# EAGLE board touch_glove (EAGLE 8.6.2)
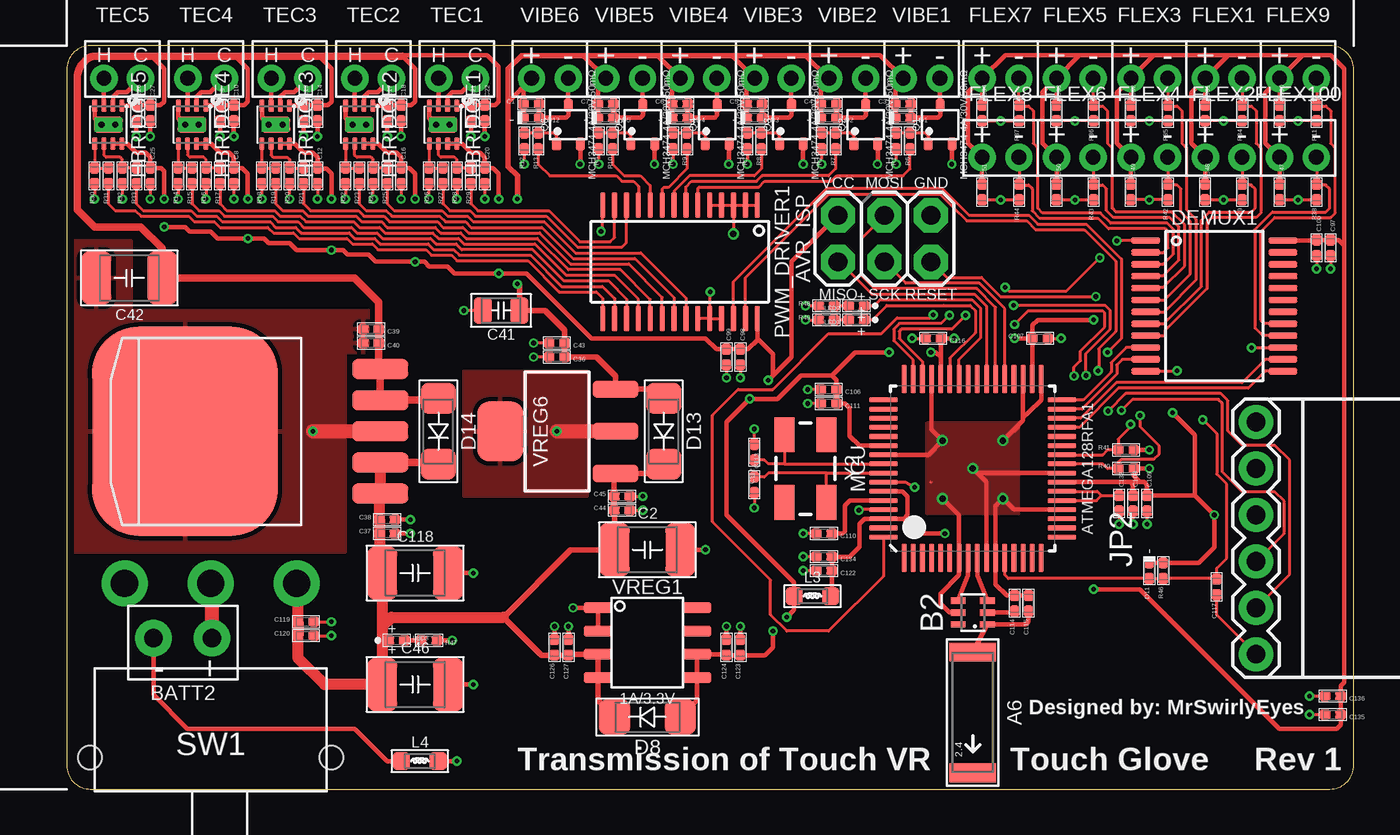
[diagram p5: board, top side]
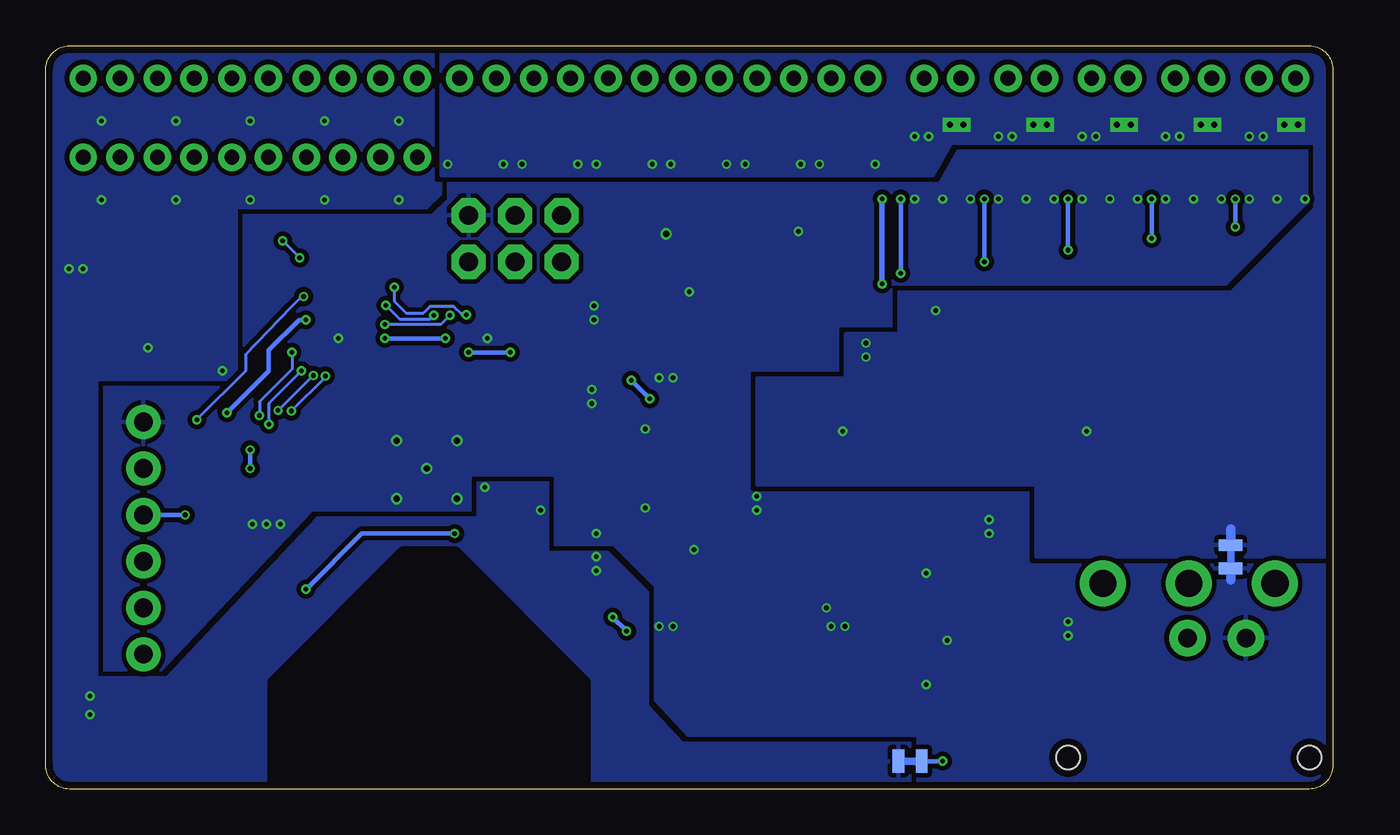
[diagram p6: board, bottom side, seen from below]

Size 70.36 x 40.64 mm. Coordinates in mm from the lower left corner, seen from the top.
Outline: 69.06,40.64 1.3,40.64 arc90 0,39.34 0,1.3 arc90 1.3,0 69.06,0 arc90 70.36,1.3 70.36,39.34 arc90 69.06,40.64
Copper layers (1*16): Top 0.035559375mm / dielectric 1.6mm / Bottom 0.035559375mm
Design rules "oshpark-2layer": minimum track width 6mil, minimum drill 10mil, track to track 6mil, track to pad 6mil, pad to pad 6mil, via to via 6mil, smd to smd 6mil, copper to edge 15mil, drill to drill 6mil, minimum pad ring 5mil, minimum via ring 5mil, stop-mask expansion 2.5mil, vias tented up to drill 0mil, thermal gap 10mil
bRestrict: area 40.9,0.5 to 57.9,13

## Footprints (pad centres in the part's own frame; a part is rotated, then mirrored left to right if it is on the bottom)
ANTENNA-CHIP5 = smd 1.016 x 2.54: FEED -3.302,0; NC 3.302,0
2PT_GND_TIE = smd 0.635 x 1.27: P$1 -0.635,0; P$2 0.635,0
2X3-NS = drill 1.016 pad 1.88 octagon: 1 -2.54,-1.27; 2 -2.54,1.27; 3 0,-1.27; 4 0,1.27; 5 2.54,-1.27; 6 2.54,1.27
0805_BALUN = smd 0.35 x 0.8: 1 -0.65,-0.8; 2 0,-0.8; 3 0.65,-0.8; 4 0.65,0.8; 5 0,0.8; 6 -0.65,0.8
DUAL_PTH_PADS = drill 1 pad 2: + -1.6,0; - 1.6,0
_CER_SMD_0402 = smd 0.6 x 0.55: 1 -0.425,0; 2 0.425,0
_CER_SMD-1210 = smd 1.65 x 2.9: 1 -1.8,0; 2 1.8,0
_CER_SMD-805 = smd 1 x 1.45: 1 -1,0; 2 1,0
SOD-923F/0402 = smd 0.6 x 0.55: A -0.425,0; K 0.425,0
SOD123F = smd 1.7 x 1.9: A -1.8,0; K 1.8,0
SSOP-24 = smd 1.6 x 0.35: 1 -3.75,3.575; 2 -3.75,2.925; 3 -3.75,2.275; 4 -3.75,1.625; 5 -3.75,0.975; 6 -3.75,0.325; 7 -3.75,-0.325; 8 -3.75,-0.975; 9 -3.75,-1.625; 10 -3.75,-2.275; 11 -3.75,-2.925; 12 -3.75,-3.575; 13 3.75,-3.575; 14 3.75,-2.925; 15 3.75,-2.275; 16 3.75,-1.625; 17 3.75,-0.975; 18 3.75,-0.325; 19 3.75,0.325; 20 3.75,0.975; 21 3.75,1.625; 22 3.75,2.275; 23 3.75,2.925; 24 3.75,3.575
CONNECTOR_FSR = drill 0.8 pad 1.5: + -1,-1.27; - 1,-1.27
WSON-8-PPAD = smd 0.7 x 0.28: 1 -1.035,0.75; 2 -1.035,0.25; 3 -1.035,-0.25; 4 -1.035,-0.75; 5 1.035,-0.75; 6 1.035,-0.25; 7 1.035,0.25; 8 1.035,0.75 | smd 0.9 x 1.6: GND 0,0 | drill 0.33 pad 0.75 square: P$1 0,-0.38; P$2 0,0.37
FTDI_BASIC-6PIN-MALE-RA = drill 1.016 pad 1.88: CTS 10.16,0; DTR 0,0; GND 12.7,0; RXI 2.54,0; TXO 5.08,0; VCC 7.62,0
_SMD-0603 = smd 0.95 x 1: 1 -1,0; 2 1,0
LED_SMD-0402 = smd 0.6 x 0.55: A -0.425,0; K 0.425,0
VFQFN-64 = smd 1.562 x 0.28: 1 -4.881,3.75; 2 -4.881,3.25; 3 -4.881,2.75; 4 -4.881,2.25; 5 -4.881,1.75; 6 -4.881,1.25; 7 -4.881,0.75; 8 -4.881,0.25; 9 -4.881,-0.25; 10 -4.881,-0.75; 11 -4.881,-1.25; 12 -4.881,-1.75; 13 -4.881,-2.25; 14 -4.881,-2.75; 15 -4.881,-3.25; 16 -4.881,-3.75; 33 4.881,-3.75; 34 4.881,-3.25; 35 4.881,-2.75; 36 4.881,-2.25; 37 4.881,-1.75; 38 4.881,-1.25; 39 4.881,-0.75; 40 4.881,-0.25; 41 4.881,0.25; 42 4.881,0.75; 43 4.881,1.25; 44 4.881,1.75; 45 4.881,2.25; 46 4.881,2.75; 47 4.881,3.25; 48 4.881,3.75 | smd 0.28 x 1.562: 17 -3.75,-4.881; 18 -3.25,-4.881; 19 -2.75,-4.881; 20 -2.25,-4.881; 21 -1.75,-4.881; 22 -1.25,-4.881; 23 -0.75,-4.881; 24 -0.25,-4.881; 25 0.25,-4.881; 26 0.75,-4.881; 27 1.25,-4.881; 28 1.75,-4.881; 29 2.25,-4.881; 30 2.75,-4.881; 31 3.25,-4.881; 32 3.75,-4.881; 49 3.75,4.881; 50 3.25,4.881; 51 2.75,4.881; 52 2.25,4.881; 53 1.75,4.881; 54 1.25,4.881; 55 0.75,4.881; 56 0.25,4.881; 57 -0.25,4.881; 58 -0.75,4.881; 59 -1.25,4.881; 60 -1.75,4.881; 61 -2.25,4.881; 62 -2.75,4.881; 63 -3.25,4.881; 64 -3.75,4.881
TSSOP-28 = smd 1.4 x 0.3: 1 -3.1,4.225; 2 -3.1,3.575; 3 -3.1,2.925; 4 -3.1,2.275; 5 -3.1,1.625; 6 -3.1,0.975; 7 -3.1,0.325; 8 -3.1,-0.325; 9 -3.1,-0.975; 10 -3.1,-1.625; 11 -3.1,-2.275; 12 -3.1,-2.925; 13 -3.1,-3.575; 14 -3.1,-4.225; 15 3.1,-4.225; 16 3.1,-3.575; 17 3.1,-2.925; 18 3.1,-2.275; 19 3.1,-1.625; 20 3.1,-0.975; 21 3.1,-0.325; 22 3.1,0.325; 23 3.1,0.975; 24 3.1,1.625; 25 3.1,2.275; 26 3.1,2.925; 27 3.1,3.575; 28 3.1,4.225
SC-70FL/MCPH3 = smd 0.5 x 0.7: 1 -0.65,-1.05; 2 0.65,-1.05; 3 0,1.05
RESISTOR_SMD-0402 = smd 0.6 x 0.55: 1 -0.425,0; 2 0.425,0
SW_SLIDE_RA_SPDT_4A-28V_L12.7-W9.5 = drill 1.5 pad 2.5: P 0,-4.765; S1 -4.7,-4.765; S2 4.7,-4.765 | hole 1.3: -6.605,4.765; 6.605,4.765
CONNECTOR_PELTIER = drill 0.8 pad 1.5: COLD 1,-1.27; HOT -1,-1.27
CONNECTOR_VIBE-MOTOR = drill 0.8 pad 1.5: 1 -1,-1.27; 2 1,-1.27
SOIC-8_W3.9MM = smd 1.55 x 0.6: 1 -2.7,1.905; 2 -2.7,0.635; 3 -2.7,-0.635; 4 -2.7,-1.905; 5 2.7,-1.905; 6 2.7,-0.635; 7 2.7,0.635; 8 2.7,1.905
SOT223-4 = smd 0.95 x 2.5: 1 -2.3,-3.199; 2 0,-3.199; 3 2.3,-3.199 | smd 3.25 x 2.5: TAB 0,3.099
DDPAK-5 = smd 1.067 x 3.048: 1 -3.404,-8.763; 2 -1.702,-8.763; 3 0,-8.763; 4 1.702,-8.763; 5 3.404,-8.763 | smd 11.43 x 10.16: TAB 0,1.905
CRYSTAL-SMD-5X3 = smd 1.9 x 1.1: 1 -1.85,-1.15; 2 1.85,-1.15; 3 1.85,1.15; 4 -1.85,1.15

## Placement (x,y rotation side)
A6  2.4GHz/802.11/0.5dBi/3W  [ANTENNA-CHIP5]  49.53,4.19 270 top
ANALOG_BR  2PT_GND_TIE  [2PT_GND_TIE]  23.11,1.52 180 bottom
AVR_ISP  AVR ISP  [2X3-NS]  44.7,30.1 0 top
B2  Impedence UNBAL/BAL (50Ω/100Ω)  [0805_BALUN]  49.53,9.65 90 top
BATT2  BATTERYPTH_HOLES  [DUAL_PTH_PADS]  6.35,8.26 180 top
C1  0.1uF/50V  [_CER_SMD_0402]  25.4,37.47 0 top
C2  100uF/16V  [_CER_SMD-1210]  31.75,13.08 0 top
C3  0.1uF/50V  [_CER_SMD_0402]  45.72,37.47 0 top
C4  0.1uF/50V  [_CER_SMD_0402]  41.66,37.47 0 top
C5  0.1uF/50V  [_CER_SMD_0402]  37.59,37.47 0 top
C6  0.1uF/50V  [_CER_SMD_0402]  33.53,37.47 0 top
C7  0.1uF/50V  [_CER_SMD_0402]  29.46,37.47 0 top
C8  0.1uF/50V  [_CER_SMD_0402]  9.14,33.53 270 top
C9  0.1uF/50V  [_CER_SMD_0402]  8.38,36.96 270 top
C10  10uF/10V  [_CER_SMD_0402]  9.14,36.96 270 top
C12  0.1uF/50V  [_CER_SMD_0402]  13.72,33.53 270 top
C13  0.1uF/50V  [_CER_SMD_0402]  12.95,36.96 270 top
C14  10uF/10V  [_CER_SMD_0402]  13.72,36.96 270 top
C16  0.1uF/50V  [_CER_SMD_0402]  18.29,33.53 270 top
C17  0.1uF/50V  [_CER_SMD_0402]  17.53,36.96 270 top
C18  10uF/10V  [_CER_SMD_0402]  18.29,36.96 270 top
C20  0.1uF/50V  [_CER_SMD_0402]  22.86,33.53 270 top
C21  0.1uF/50V  [_CER_SMD_0402]  22.1,36.96 270 top
C22  10uF/10V  [_CER_SMD_0402]  22.86,36.96 270 top
C25  0.1uF/50V  [_CER_SMD_0402]  4.57,33.53 270 top
C26  0.1uF/50V  [_CER_SMD_0402]  3.81,36.96 270 top
C27  10uF/10V  [_CER_SMD_0402]  4.57,36.96 270 top
C30  0.1uF/50V  [_CER_SMD_0402]  66.29,36.96 270 top
C31  0.1uF/50V  [_CER_SMD_0402]  62.23,36.96 270 top
C32  0.1uF/50V  [_CER_SMD_0402]  58.17,36.96 270 top
C33  0.1uF/50V  [_CER_SMD_0402]  54.1,36.96 270 top
C34  0.1uF/50V  [_CER_SMD_0402]  50.04,36.96 270 top
C36  0.1uF/50V  [_CER_SMD_0402]  26.8,23.62 180 top
C37  10uF/10V  [_CER_SMD_0402]  17.53,13.97 0 top
C38  0.1uF/50V  [_CER_SMD_0402]  17.53,14.73 0 top
C39  10uF/10V  [_CER_SMD_0402]  16.64,25.15 180 top
C40  0.1uF/50V  [_CER_SMD_0402]  16.64,24.38 180 top
C41  47uF/10V  [_CER_SMD-805]  23.75,26.16 180 top
C42  100uF/16V  [_CER_SMD-1210]  3.43,27.94 180 top
C43  10uF/10V  [_CER_SMD_0402]  26.8,24.38 180 top
C44  10uF/10V  [_CER_SMD_0402]  30.35,15.24 0 top
C45  0.1uF/50V  [_CER_SMD_0402]  30.35,16 0 top
C46  100uF/16V  [_CER_SMD-1210]  19.05,5.71 0 top
C47  0.1uF/50V  [_CER_SMD_0402]  66.29,32.64 270 top
C48  0.1uF/50V  [_CER_SMD_0402]  62.23,32.64 270 top
C49  0.1uF/50V  [_CER_SMD_0402]  58.17,32.64 270 top
C50  0.1uF/50V  [_CER_SMD_0402]  54.1,32.64 270 top
C51  0.1uF/50V  [_CER_SMD_0402]  50.04,32.64 270 top
C97  10uF/10V  [_CER_SMD_0402]  69.09,29.59 270 top
C98  0.1uF/50V  [_CER_SMD_0402]  36.83,23.62 270 top
C99  10uF/10V  [_CER_SMD_0402]  36.07,23.62 270 top
C100  0.1uF/50V  [_CER_SMD_0402]  68.33,29.59 270 top
C106  0.1uF/50V  [_CER_SMD_0402]  41.66,21.84 180 top
C107  1uF/25V  [_CER_SMD_0402]  53.21,24.64 0 top
C108  0.1uF/50V  [_CER_SMD_0402]  58.29,15.62 270 top
C109  1uF/25V  [_CER_SMD_0402]  59.05,15.62 270 top
C110  1uF/25V  [_CER_SMD_0402]  41.4,13.97 180 top
C111  1uF/25V  [_CER_SMD_0402]  41.66,21.08 180 top
C112  12pF/100V  [_CER_SMD_0402]  37.59,18.41 90 top
C113  12pF/100V  [_CER_SMD_0402]  37.59,16.64 270 top
C114  22pF/50V  [_CER_SMD_0402]  51.82,10.16 90 top
C115  0.75pF/50V  [_CER_SMD_0402]  52.58,10.16 90 top
C116  0.1uF/50V  [_CER_SMD_0402]  47.37,24.64 180 top
C117  0.1uF/50V  [_CER_SMD_0402]  62.87,11.05 90 top
C118  100uF/16V  [_CER_SMD-1210]  19.05,11.81 0 top
C119  0.1uF/50V  [_CER_SMD_0402]  13.08,9.14 0 top
C120  10uF/10V  [_CER_SMD_0402]  13.08,8.38 0 top
C122  0.1uF/50V  [_CER_SMD_0402]  41.4,11.94 180 top
C123  10uF/10V  [_CER_SMD_0402]  36.83,7.75 90 top
C124  0.1uF/50V  [_CER_SMD_0402]  36.07,7.75 90 top
C126  10uF/10V  [_CER_SMD_0402]  26.67,7.75 90 top
C127  0.1uF/50V  [_CER_SMD_0402]  27.43,7.75 90 top
C132  1uF/25V  [_CER_SMD_0402]  57.53,15.62 270 top
C134  1uF/25V  [_CER_SMD_0402]  41.4,12.7 180 top
C135  0.1uF/50V  [_CER_SMD_0402]  69.22,4.06 180 top
C136  1uF/25V  [_CER_SMD_0402]  69.22,5.08 180 top
D1  150mA/75V  [SOD-923F/0402]  45.72,36.7 180 top
D2  150mA/75V  [SOD-923F/0402]  41.66,36.7 180 top
D3  150mA/75V  [SOD-923F/0402]  37.59,36.7 180 top
D4  150mA/75V  [SOD-923F/0402]  33.53,36.7 180 top
D5  150mA/75V  [SOD-923F/0402]  29.46,36.7 180 top
D8  1A/50V  [SOD123F]  31.75,3.94 180 top
D11  150mA/75V  [SOD-923F/0402]  59.18,11.94 90 top
D12  150mA/75V  [SOD-923F/0402]  25.4,36.7 180 top
D13  1A/50V  [SOD123F]  32.64,19.56 270 top
D14  1A/50V  [SOD123F]  20.32,19.56 270 top
DEMUX1  CH16_MUX-DEMUX  [SSOP-24]  62.74,26.42 0 top
FLEX1  10K  [CONNECTOR_FSR]  63.25,40.13 0 top
FLEX2  10K  [CONNECTOR_FSR]  63.25,35.81 0 top
FLEX3  10K  [CONNECTOR_FSR]  59.18,40.13 0 top
FLEX4  10K  [CONNECTOR_FSR]  59.18,35.81 0 top
FLEX5  10K  [CONNECTOR_FSR]  55.12,40.13 0 top
FLEX6  10K  [CONNECTOR_FSR]  55.12,35.81 0 top
FLEX7  10K  [CONNECTOR_FSR]  51.05,40.13 0 top
FLEX8  10K  [CONNECTOR_FSR]  51.05,35.81 0 top
FLEX9  10K  [CONNECTOR_FSR]  67.31,40.13 0 top
FLEX100  10K  [CONNECTOR_FSR]  67.31,35.81 0 top
HBRIDGE1  DRV8837C  [WSON-8-PPAD]  20.57,36.32 270 top
HBRIDGE2  DRV8837C  [WSON-8-PPAD]  16,36.32 270 top
HBRIDGE3  DRV8837C  [WSON-8-PPAD]  11.43,36.32 270 top
HBRIDGE4  DRV8837C  [WSON-8-PPAD]  6.86,36.32 270 top
HBRIDGE5  DRV8837C  [WSON-8-PPAD]  2.29,36.32 270 top
JP2  FTDIPTH-RA  [FTDI_BASIC-6PIN-MALE-RA]  65.02,7.37 90 top
L3  10uH/0.38A  [_SMD-0603]  40.77,10.54 0 top
L4  10uH/0.38A  [_SMD-0603]  19.3,1.52 0 top
LED1  GREEN  [LED_SMD-0402]  43.18,25.65 180 top
LED2  RED  [LED_SMD-0402]  43.18,26.42 180 top
LED3  BLUE  [LED_SMD-0402]  18.03,8.13 0 top
MCU  ATMEGA128RFA1  [VFQFN-64]  49.53,17.53 90 top
NOISE_BR  2PT_GND_TIE  [2PT_GND_TIE]  5.59,12.7 270 bottom
PWM_DRIVER1  PCA9685  [TSSOP-28]  33.53,28.83 270 top
Q1  MCH3474 4A/30V/50mΩ  [SC-70FL/MCPH3]  47.75,36.32 0 top
Q2  MCH3474 4A/30V/50mΩ  [SC-70FL/MCPH3]  43.69,36.32 0 top
Q3  MCH3474 4A/30V/50mΩ  [SC-70FL/MCPH3]  39.62,36.32 0 top
Q4  MCH3474 4A/30V/50mΩ  [SC-70FL/MCPH3]  35.56,36.32 0 top
Q5  MCH3474 4A/30V/50mΩ  [SC-70FL/MCPH3]  31.5,36.32 0 top
Q6  MCH3474 4A/30V/50mΩ  [SC-70FL/MCPH3]  27.43,36.32 0 top
R1  10KΩ  [RESISTOR_SMD-0402]  45.34,35.43 90 top
R2  10KΩ  [RESISTOR_SMD-0402]  41.27,35.43 90 top
R3  10KΩ  [RESISTOR_SMD-0402]  37.21,35.43 90 top
R4  10KΩ  [RESISTOR_SMD-0402]  33.15,35.43 90 top
R5  10KΩ  [RESISTOR_SMD-0402]  29.08,35.43 90 top
R6  100Ω  [RESISTOR_SMD-0402]  46.1,35.43 90 top
R7  100Ω  [RESISTOR_SMD-0402]  42.04,35.43 90 top
R8  100Ω  [RESISTOR_SMD-0402]  37.97,35.43 90 top
R9  100Ω  [RESISTOR_SMD-0402]  33.91,35.43 90 top
R10  100Ω  [RESISTOR_SMD-0402]  29.84,35.43 90 top
R11  47KΩ  [RESISTOR_SMD-0402]  68.33,36.96 90 top
R12  10KΩ  [RESISTOR_SMD-0402]  25.02,35.43 90 top
R13  100Ω  [RESISTOR_SMD-0402]  25.78,35.43 90 top
R14  10KΩ  [RESISTOR_SMD-0402]  6.1,33.53 90 top
R15  100Ω  [RESISTOR_SMD-0402]  6.86,33.53 90 top
R16  10KΩ  [RESISTOR_SMD-0402]  7.62,33.53 90 top
R17  100Ω  [RESISTOR_SMD-0402]  8.38,33.53 90 top
R18  10KΩ  [RESISTOR_SMD-0402]  10.67,33.53 90 top
R19  100Ω  [RESISTOR_SMD-0402]  11.43,33.53 90 top
R20  10KΩ  [RESISTOR_SMD-0402]  12.19,33.53 90 top
R21  100Ω  [RESISTOR_SMD-0402]  12.95,33.53 90 top
R22  10KΩ  [RESISTOR_SMD-0402]  15.24,33.53 90 top
R23  100Ω  [RESISTOR_SMD-0402]  16,33.53 90 top
R24  10KΩ  [RESISTOR_SMD-0402]  16.76,33.53 90 top
R25  100Ω  [RESISTOR_SMD-0402]  17.53,33.53 90 top
R26  10KΩ  [RESISTOR_SMD-0402]  19.81,33.53 90 top
R27  100Ω  [RESISTOR_SMD-0402]  20.57,33.53 90 top
R28  10KΩ  [RESISTOR_SMD-0402]  21.34,33.53 90 top
R29  100Ω  [RESISTOR_SMD-0402]  22.1,33.53 90 top
R30  10KΩ  [RESISTOR_SMD-0402]  1.52,33.53 90 top
R31  100Ω  [RESISTOR_SMD-0402]  2.29,33.53 90 top
R32  10KΩ  [RESISTOR_SMD-0402]  3.05,33.53 90 top
R33  100Ω  [RESISTOR_SMD-0402]  3.81,33.53 90 top
R34  47KΩ  [RESISTOR_SMD-0402]  64.26,36.96 90 top
R35  47KΩ  [RESISTOR_SMD-0402]  60.2,36.96 90 top
R36  47KΩ  [RESISTOR_SMD-0402]  56.13,36.96 90 top
R37  47KΩ  [RESISTOR_SMD-0402]  52.07,36.96 90 top
R38  47KΩ  [RESISTOR_SMD-0402]  68.33,32.64 90 top
R39  47KΩ  [RESISTOR_SMD-0402]  64.26,32.64 90 top
R40  4.7KΩ  [RESISTOR_SMD-0402]  57.91,17.53 0 top
R41  4.7KΩ  [RESISTOR_SMD-0402]  57.91,18.54 0 top
R42  47KΩ  [RESISTOR_SMD-0402]  60.2,32.64 90 top
R43  47KΩ  [RESISTOR_SMD-0402]  56.13,32.64 90 top
R44  47KΩ  [RESISTOR_SMD-0402]  52.07,32.64 90 top
R46  10KΩ  [RESISTOR_SMD-0402]  59.94,11.94 90 top
R47  10KΩ  [RESISTOR_SMD-0402]  19.81,8.13 180 top
R48  2KΩ  [RESISTOR_SMD-0402]  41.53,26.42 0 top
R49  1KΩ  [RESISTOR_SMD-0402]  41.53,25.65 0 top
SW1  4A/28V  [SW_SLIDE_RA_SPDT_4A-28V_L12.7-W9.5]  7.87,6.48 180 top
TEC1  PELTIER  [CONNECTOR_PELTIER]  21.34,40.13 0 top
TEC2  PELTIER  [CONNECTOR_PELTIER]  16.76,40.13 0 top
TEC3  PELTIER  [CONNECTOR_PELTIER]  12.19,40.13 0 top
TEC4  PELTIER  [CONNECTOR_PELTIER]  7.62,40.13 0 top
TEC5  PELTIER  [CONNECTOR_PELTIER]  3.05,40.13 0 top
VIBE1  VIBE_MOTOR  [CONNECTOR_VIBE-MOTOR]  46.74,40.13 0 top
VIBE2  VIBE_MOTOR  [CONNECTOR_VIBE-MOTOR]  42.67,40.13 0 top
VIBE3  VIBE_MOTOR  [CONNECTOR_VIBE-MOTOR]  38.61,40.13 0 top
VIBE4  VIBE_MOTOR  [CONNECTOR_VIBE-MOTOR]  34.54,40.13 0 top
VIBE5  VIBE_MOTOR  [CONNECTOR_VIBE-MOTOR]  30.48,40.13 0 top
VIBE6  VIBE_MOTOR  [CONNECTOR_VIBE-MOTOR]  26.42,40.13 0 top
VREG1  1A/3.3V  [SOIC-8_W3.9MM]  31.75,8 0 top
VREG6  TL1963A-33 1.5A/3.3V  [SOT223-4]  26.8,19.56 90 top
VREG7  3A/1.8V  [DDPAK-5]  8.38,19.56 90 top
Y2  16MHz  [CRYSTAL-SMD-5X3]  40.39,17.53 270 top

## Tracks (layer width: path | path; a pad name or v marks a point on that pad's centre or on a via)
1.8V
  Top 0.254: HBRIDGE1.1 22.07,37.36 C21.1 C22.1 23.41,37.38 23.62,37.59 23.62,39.5 22.99,40.13 18.16,40.13 18.24,40.06 18.36,40.06 19.05,39.37 19.05,37.59 18.84,37.38 C18.1 C17.1 17.5,37.36 HBRIDGE2.1 | HBRIDGE3.1 12.93,37.36 C13.1 C14.1 14.27,37.38 14.48,37.59 14.48,39.37 13.79,40.06 | HBRIDGE4.1 7.63,37.38 C9.1 C10.1 9.7,37.38 9.91,37.59 9.91,39.37 9.22,40.06 | HBRIDGE5.1 3.79,37.36 C26.1 C27.1 5.12,37.38 5.33,37.59 5.33,39.37 4.65,40.06
  Top 0.406: 17.06,22.79 C40.1 C39.1 17.06,26.63 15.75,27.94 C42.1 5.23,29.57 4.06,30.73 1.52,30.73 0.58,31.67 0.58,38.91 arc-45 0.91,39.69 1.1,39.89 arc-45 1.5,40.06 4.65,40.06 9.22,40.06 13.79,40.06 18.36,40.06 | VREG7.5 VREG7.4 20.22,21.26 D14.A
  Top 0.508: 17.06,22.79 VREG7.5
3.3V  (via drill 0.25)
  Top 0.254: D12.K C1.1 24.98,38.42 VIBE6.1 24.15,37.59 24.13,37.59 | D5.K C7.1 29.04,38.42 VIBE5.1 28.23,40.11 28.19,40.11 | D4.K C6.1 33.1,38.42 VIBE4.1 32.3,40.11 32.26,40.11 | D3.K C5.1 37.17,38.42 VIBE3.1 36.36,40.11 36.32,40.11 | D2.K C4.1 41.23,38.42 VIBE2.1 41.63,38.86 40.39,40.11 40.41,40.13 44.47,40.13 VIBE1.1 45.3,38.42 C3.1 D1.K
  Top 0.305: VREG6.3 29.93,21.93 | 24.62,27.6 v24.64,27.61 24.75,27.5 C41.1 26.16,26.16 27.22,25.1 C43.1 C36.1 28.96,23.62 30,22.58 VREG6.3 | v24.64,32.26 24.64,33.53 24.13,34.04 24.13,37.59 24.13,39.37 24.87,40.11 28.19,40.11 32.26,40.11 36.32,40.11 40.39,40.11 | D13.A 32.14,21.86 VREG6.3 | 30.14,22 VREG6.3
  Bottom 0.305: v24.64,27.61 v24.64,32.26
A1  (via drill 0.25)
  Top 0.152: DEMUX1.1 58.97,29.97 v57.4,29.97 | MCU.64 44.65,11.63 41.66,8.64 39.37,8.64 38.48,9.53 38.48,11.43 35.31,14.61 35.31,20.45 36.7,21.84 38.61,21.84 41.66,24.89 44.53,24.89 45.39,25.76 47.19,25.76 v47.37,25.93 | v51.31,27.43 51.51,27.23 54.66,27.23 v56.48,29.05
  Bottom 0.152: v57.4,29.97 v56.48,29.05 | v51.31,27.43 51.31,26.67 50.67,26.04 49.7,26.04 49.35,26.39 48.06,26.39 47.6,25.93 v47.37,25.93
AGND  (via drill 0.25)
  Top 0.152: C34.2 v51.05,36.53 R37.1 | C51.2 v51.05,32.21 R44.1 | C50.2 v55.12,32.21 R43.1 | R42.1 v59.18,32.21 C49.2 | C48.2 v63.25,32.21 R39.1 | C47.2 v67.31,32.21 R38.1 | R11.1 v67.31,36.53 C30.2 | R34.1 v63.25,36.53 C31.2 | R35.1 v59.18,36.53 C32.2 | R36.1 v55.12,36.53 C33.2 | DEMUX1.15 64.78,24.14 v64.77,24.13 | DEMUX1.12 60.69,22.84 v60.71,22.86 | C136.2 v67.94,5.08 | C135.2 v67.94,4.06 | C134.2 v40.26,12.7 | C122.2 v40.26,11.94 | MCU.58 45.85,16.78 v46.35,16.51 | MCU.61 43.43,15.28 v43.31,15.24 | C100.2 v68.33,28.45 | C97.2 v69.09,28.45
  pour Bottom (isolate 0.254, rank 4): 48.77,40.64 48.77,32.51 49.53,31.75 59.94,31.75 59.94,22.35 67.56,22.35 67.56,6.1 63.75,6.1 55.5,14.86 46.74,14.86 46.74,16.76 42.93,16.76 42.93,12.95 39.62,12.95 37.47,10.79 37.47,4.57 35.56,2.54 23.11,2.54 23.11,0 70.36,0 70.36,40.64
AVCC  (via drill 0.25)
  Top 0.254: C34.1 50.05,37.42 FLEX7.+ | C51.1 50.04,34.53 FLEX8.+ 49.28,35.32 49.28,38.1 50.04,38.86 FLEX7.+ | C30.1 66.31,37.42 FLEX9.+ | C31.1 62.25,37.42 FLEX1.+ | C32.1 58.18,37.42 FLEX3.+ | C33.1 54.12,37.42 FLEX5.+ | C50.1 54.12,33.1 FLEX6.+ 53.34,35.32 53.34,38.1 54.1,38.86 FLEX5.+ | C49.1 58.18,33.1 FLEX4.+ 57.4,35.32 57.4,38.08 FLEX3.+ | C48.1 62.25,33.1 FLEX2.+ 61.47,35.32 61.47,38.08 FLEX1.+ | C47.1 66.31,33.1 FLEX100.+ 65.53,35.32 65.53,38.08 FLEX9.+ | FLEX7.+ 50.05,38.88 51.31,40.13 55.37,40.13 | 59.44,40.13 55.37,40.13 | 63.5,40.13 59.44,40.13 | 67.56,40.13 63.5,40.13 | 67.56,40.13 69.09,40.13 69.85,39.37 69.85,29.72 | FLEX5.+ 55.37,40.12 55.37,40.13 | FLEX3.+ 59.44,40.12 59.44,40.13 | FLEX1.+ 63.5,40.12 63.5,40.13 | FLEX9.+ 67.56,40.12 67.56,40.13 | DEMUX1.24 68.3,29.99 C100.1 C97.1 69.55,30.02 69.85,29.72 | 69.85,29.72 69.85,5.84 69.64,5.63 C136.1 C135.1 69.64,3.51 69.43,3.3 66.29,3.3 58.67,10.92 v56.13,10.92 | L3.2 41.83,10.86 C122.1 C134.1 42.8,12.7 43.33,13.23 43.33,14.5 43.6,14.78 MCU.62 45.76,14.78 | MCU.59 45.7,16.28 45.97,16 45.97,14.99 45.76,14.78 | 45.76,14.78 46.57,13.97 v48.01,13.97
  Bottom 0.254: v56.13,10.92 53.09,13.97 v48.01,13.97
BATT_+
  Top 0.762: BATT2.+ 7.95,11.17 SW1.P
GND  (via drill 0.25, 0.35)
  Top 0.152: v19.81,32.26 R26.1 | R28.1 v21.34,32.26 | C20.2 v22.86,32.26 | C16.2 v18.29,32.26 | v16.76,32.26 R24.1 | R22.1 v15.24,32.26 | R18.1 v10.67,32.26 | v12.19,32.26 R20.1 | C12.2 v13.72,32.26 | R14.1 v6.1,32.26 | R16.1 v7.62,32.26 | C8.2 v9.14,32.26 | R30.1 v1.52,32.26 | R32.1 v3.05,32.26 | C25.2 v4.57,32.26 | PWM_DRIVER1.5 PWM_DRIVER1.4 PWM_DRIVER1.3 | PWM_DRIVER1.3 PWM_DRIVER1.2 PWM_DRIVER1.1 | v29.21,30.5 29.3,30.66 PWM_DRIVER1.14 | PWM_DRIVER1.24 PWM_DRIVER1.23 | PWM_DRIVER1.24 PWM_DRIVER1.25 | PWM_DRIVER1.3 v36.45,30.35 | PWM_DRIVER1.24 35.18,25.75 | v35.18,27.18 35.15,27.15 PWM_DRIVER1.24 | C112.2 v37.59,19.68 | C113.2 v37.59,15.37 | v46.23,24.64 C116.2 | C119.2 v14.48,9.14 | C120.2 v14.48,8.38 | R48.1 v40.39,26.42 | v40.39,25.65 R49.1 | C110.2 v40.26,13.97 | C106.2 v40.51,21.84 | C111.2 v40.51,21.08 | C99.2 v36.07,22.48 | C98.2 v36.83,22.48 | C45.2 v31.5,16 | C44.2 v31.5,15.24 | C132.2 v57.53,14.48 | C108.2 v58.29,14.48 | C109.2 v59.05,14.48 | 47.23,16.78 47.24,16.76 | 52.03,19.78 51.82,19.56 | C107.2 v54.36,24.64
  Top 0.254: L4.1 17.53,1.52 15.75,3.3 6.6,3.3 4.75,5.16 BATT2.- | C46.2 v22.23,5.71 | R47.1 v21.08,8.13 | C118.2 v22.23,11.81 | C37.2 v18.8,13.97 | C38.2 v18.8,14.73 | C126.2 v26.67,8.89 | C127.2 v27.43,8.89 | C124.2 v36.07,8.89 | C123.2 v36.83,8.89 | VREG1.2 VREG1.1 v27.69,9.91 | v47.88,15.88 48.78,14.97 MCU.7 48.78,11.7 47.75,10.67 47.75,10.16 48.26,9.65 B2.5 | MCU.10 50.28,16.78 49.78,17.28 | 49.78,17.28 v49.53,17.53 | C115.2 C114.2 51.39,10.59 50.78,11.2 MCU.11 50.78,15.47 v51.18,15.88 51.78,15.28 MCU.20 | MCU.24 49.78,17.28 | 52.28,20.32 52.28,20.15 v51.18,19.05 | 52.28,20.32 MCU.35 | MCU.45 47.28,19.65 v47.88,19.05 47.1,18.28 MCU.55 | C2.2 v34.92,13.08 | MCU.33 53.28,21.28 52.58,20.57 52.28,20.32
  Bottom 0.508: NOISE_BR.P$2 5.59,11.43
  pour Bottom (isolate 0.254, rank 6): 70.36,40.64 70.36,0 0,0 0,40.64
  pour Top (isolate 0.254): 47.04,20.04 52.04,20.04 52.04,15.04 47.04,15.04
MISO
  Top 0.152: AVR_ISP.1 42.24,28.83 44.02,27.05 49.63,27.05 50.28,26.4 MCU.39
MOSI
  Top 0.152: AVR_ISP.4 43.43,30.1 43.43,28.07 44.15,27.36 49.76,27.36 50.78,26.33 MCU.38
N$1
  Top 0.254: HBRIDGE5.3 2.04,38.85 TEC5.HOT
N$2
  Top 0.254: VIBE4.2 35.54,37.39 Q4.3 35.56,36.83 35.43,36.7 D4.A C6.2
N$3
  Top 0.254: VIBE5.2 31.48,37.39 Q5.3 31.5,36.83 31.37,36.7 D5.A C7.2
N$4
  Top 0.254: VIBE3.2 39.61,37.39 Q3.3 39.62,36.83 39.5,36.7 D3.A C5.2
N$5
  Top 0.254: TEC5.COLD 3.29,38.1 2.79,38.1 2.54,37.84 HBRIDGE5.2
N$6
  Top 0.254: TEC4.COLD 7.87,38.12 7.87,38.1 7.37,38.1 7.11,37.84 HBRIDGE4.2
N$7
  Top 0.152: R2.2 R7.2 42.88,35.86 43.04,35.7 Q2.1
N$8
  Top 0.152: HBRIDGE4.5 6.1,35.27 R14.2 R15.2
N$9
  Top 0.152: Q3.1 38.97,35.7 38.82,35.86 R8.2 R3.2
N$10
  Top 0.152: R17.2 R16.2 7.62,34.42 7.49,34.54 6.73,34.54 6.61,34.67 HBRIDGE4.6
N$11
  Top 0.254: HBRIDGE4.3 6.61,38.85 TEC4.HOT
N$12
  Top 0.254: HBRIDGE3.3 TEC3.HOT
N$13
  Top 0.152: HBRIDGE3.5 10.67,35.27 R18.2 R19.2
N$14
  Top 0.152: R21.2 R20.2 12.19,34.42 12.06,34.54 11.3,34.54 11.18,34.67 HBRIDGE3.6
N$15
  Top 0.254: VIBE2.2 43.67,37.39 Q2.3 43.69,36.83 43.56,36.7 D2.A C4.2
N$16
  Top 0.254: TEC3.COLD 12.43,38.1 11.94,38.1 11.68,37.84 HBRIDGE3.2
N$17
  Top 0.254: VIBE1.2 47.74,37.39 Q1.3 47.75,36.83 47.62,36.7 D1.A C3.2
N$18
  Top 0.254: HBRIDGE2.3 TEC2.HOT
N$19
  Top 0.152: HBRIDGE2.5 15.24,35.27 R22.2 R23.2
N$20
  Top 0.152: R25.2 R24.2 16.76,34.42 16.64,34.54 15.88,34.54 15.75,34.67 HBRIDGE2.6
N$21
  Top 0.152: Q4.1 34.91,35.7 34.75,35.86 R9.2 R4.2
N$22
  Top 0.152: Q5.1 30.85,35.7 30.69,35.86 R10.2 R5.2
N$23
  Top 0.254: TEC2.COLD 17,38.1 16.51,38.1 16.25,37.84 HBRIDGE2.2
N$24
  Top 0.254: TEC1.HOT 20.32,38.85 HBRIDGE1.3
N$25
  Top 0.152: HBRIDGE1.5 19.82,33.97 R26.2 R27.2
N$26
  Top 0.152: R29.2 R28.2 21.34,34.42 21.21,34.54 20.45,34.54 20.32,34.67 HBRIDGE1.6
N$27
  Top 0.254: HBRIDGE1.2 20.83,37.85 21.08,38.1 21.59,38.1 22.34,38.85 TEC1.COLD
N$28
  Top 0.152: Q1.1 47.1,35.7 46.95,35.86 R6.2 R1.2
N$29
  Top 0.152: HBRIDGE5.5 1.54,33.97 R30.2 R31.2
N$30
  Top 0.254: VIBE6.2 27.42,37.39 Q6.3 27.43,36.83 27.3,36.7 D12.A C1.2
N$31
  Top 0.152: R33.2 R32.2 3.05,34.42 2.92,34.54 2.16,34.54 2.04,34.67 HBRIDGE5.6
N$32
  Top 0.152: Q6.1 26.78,35.7 26.63,35.86 R13.2 R12.2
N$44
  Top 0.152: 41.53,17.28 MCU.57 | 41.53,17.28 38.36,17.28 38.14,17.06 C113.1 | Y2.3 41.53,17.28
N$45
  Top 0.254: MCU.9 49.78,11.69 B2.3
N$46
  Top 0.254: MCU.8 49.28,11.69 B2.4
N$47
  Top 0.254: B2.2 51.73,9.65 C114.1
N$48
  Top 0.152: 39.24,17.78 MCU.56 | 39.24,17.78 38.36,17.78 38.14,17.99 C112.1 | Y2.1 39.24,17.78
N$49
  Top 0.254: A6.FEED B2.1 52.44,9 52.58,9.14 C115.1
N$50
  Top 0.152: JP2.DTR 62.87,9.53 C117.1
N$52  (via drill 0.25)
  Top 0.254: v21.34,1.52 L4.2
  Bottom 0.254: ANALOG_BR.P$1 v21.34,1.52
N$53
  Top 0.254: LED3.K R47.2
N$54
  Top 0.152: LED1.K R49.2
N$55
  Top 0.152: LED2.K R48.2
N$62
  Top 0.152: 56.56,16.05 C132.1 | MCU.21 56.29,15.78 56.56,16.05 | MCU.22 56.33,16.28 56.56,16.05
N$63
  Top 0.254: C110.1 42.42,13.97 42.55,14.1 42.55,15.49 42.83,15.78 MCU.60
NGND  (via drill 0.25)
  Top 0.152: R1.1 v45.34,34.16 | R12.1 v25.02,34.16 | R5.1 v29.08,34.16 | R4.1 v33.15,34.16 | R3.1 v37.21,34.16 | R2.1 v41.27,34.16 | C43.2 v25.53,24.38 | C36.2 v25.53,23.62 | C41.2 v21.72,26.16
  Top 0.254: Q2.2 44.34,34.43 v44.32,34.16 | Q3.2 40.26,35.26 v40.26,34.16 | Q1.2 48.4,34.18 v48.39,34.16 | Q4.2 36.21,34.18 v36.2,34.16 | Q5.2 32.15,34.3 v32.13,34.16 | Q6.2 28.08,34.3 v28.07,34.16 | HBRIDGE1.4 19.82,36.69 HBRIDGE1.P$1 HBRIDGE1.GND HBRIDGE1.P$2 | HBRIDGE2.4 15.25,36.69 HBRIDGE2.P$1 HBRIDGE2.GND HBRIDGE2.P$2 | HBRIDGE3.4 10.68,36.69 HBRIDGE3.P$1 HBRIDGE3.GND HBRIDGE3.P$2 | HBRIDGE4.4 6.11,36.69 HBRIDGE4.P$1 HBRIDGE4.GND HBRIDGE4.P$2 | HBRIDGE5.4 1.54,36.69 HBRIDGE5.P$1 HBRIDGE5.GND HBRIDGE5.P$2 | C21.2 v22.1,35.69 | C22.2 v22.86,35.69 | C17.2 v17.53,35.69 | C18.2 v18.29,35.69 | C13.2 v12.95,35.69 | C14.2 v13.72,35.69 | C9.2 v8.38,35.69 | C10.2 v9.14,35.69 | C26.2 v3.81,35.69 | C27.2 v4.57,35.69
  Top 0.762: VREG7.3 v13.46,19.56 | VREG6.2 v26.8,19.56
  Bottom 0.508: NOISE_BR.P$1 5.59,14.22
  pour Top (rank 3): 28.45,16 21.72,16 21.72,22.86 28.45,22.86
  pour Top: 0,12.95 15.24,12.95 15.24,23.88 16.51,23.88 16.51,26.16 3.56,26.16 3.56,29.97 0,29.97
  pour Bottom (isolate 0.254, rank 3): 48.77,40.64 48.77,33.53 21.84,33.53 20.83,35.31 1.02,35.31 1.02,31.75 5.59,27.18 23.75,27.18 23.75,24.89 26.67,24.89 26.67,22.48 31.5,22.48 31.5,16.64 16.26,16.64 16.26,12.7 0,12.7 0,40.64
PB6
  Top 0.152: MCU.42 48.78,23.48 49.98,24.68 49.98,26.28 49.51,26.75 44.45,26.75 44.12,26.42 LED2.A
PB7
  Top 0.152: LED1.A 44.04,25.65 44.83,26.44 47.93,26.44 49.38,26.44 49.4,26.42 49.67,26.15 49.67,24.94 48.28,23.55 MCU.43
PD4
  Top 0.152: DEMUX1.13 66.47,22.86 65.53,22.86 64.59,21.92 57.5,21.92 55.36,19.78 MCU.29
PD5
  Top 0.152: DEMUX1.14 65.53,23.5 64.26,22.23 57.38,22.23 55.43,20.28 MCU.30
PD6
  Top 0.152: DEMUX1.11 57.7,23.49 57.4,23.19 57.4,22.68 55.5,20.78 MCU.31
PD7
  Top 0.152: DEMUX1.10 57.92,24.14 57.1,23.32 57.1,22.81 55.57,21.28 MCU.32
RESET  (via drill 0.25)
  Top 0.152: MCU.12 51.28,11.71 51.48,11.51 D11.A R46.1 62.83,11.51 C117.2 62.87,12.06 63.41,12.61 63.41,16.68 62.87,17.22 62.87,19.43 v62.1,20.19 | AVR_ISP.5 48.11,27.96 50.01,27.96 51.05,26.92 v56.26,26.92
  Bottom 0.152: v62.1,20.19 59.44,22.86 59.44,23.75 56.95,26.34 56.37,26.92 v56.26,26.92
RX0  (via drill 0.25)
  Top 0.152: JP2.TXO 66.55,13.97 66.55,15.75 66.04,16.26 64.26,16.26 63.17,17.35 63.17,21.11 62.97,21.31 58.27,21.31 v57.66,20.7 | v49.15,25.91 48.39,25.15 45.64,25.15 45.52,25.02 45.52,24.64 46.78,23.37 MCU.46 | v55.73,22.61 55.73,23.82 57.05,25.14 57.05,26.16 56.77,26.44 v51.76,26.44
  Bottom 0.152: v55.73,22.61 55.75,22.61 v57.66,20.7 | v49.15,25.91 49.35,25.7 51.03,25.7 v51.76,26.44
SCK
  Top 0.152: MCU.37 51.28,26.27 49.88,27.66 45.87,27.66 AVR_ISP.3
SCL  (via drill 0.25)
  Top 0.152: PWM_DRIVER1.26 36.45,27.74 40.69,31.98 41.55,32.84 47.85,32.84 49.33,31.37 52.6,31.37 53.09,30.89 55.75,30.89 57.66,28.98 57.66,24.64 v56.9,23.88 | MCU.25 56.64,17.78 56.9,17.53 R40.1 57.49,17.86 57.66,18.03 59.44,18.03 59.69,18.29 59.69,18.8 58.67,19.81 v58.67,20.42
  Bottom 0.152: v56.9,23.88 56.9,22.96 58.67,21.18 v58.67,20.42
SDA  (via drill 0.25)
  Top 0.152: 37.08,25.75 PWM_DRIVER1.27 37.1,27.96 41,31.85 41.68,32.54 47.73,32.54 48.41,31.85 49.2,31.06 52.48,31.06 52.96,30.58 55.63,30.58 57.35,28.86 57.35,25.02 56.41,24.08 56.41,22.89 v56.39,22.86 | MCU.26 56.63,18.28 56.9,18.54 R41.1 57.49,19.13 58.17,19.81 v58.17,19.94
  Bottom 0.152: v56.39,22.86 58.17,21.08 v58.17,19.94
STRAIN_1
  Top 0.152: DEMUX1.9 59.97,24.79 60.07,24.89 60.07,25.1 62.33,27.36 62.33,30.99 62.59,31.24 65.02,31.24 65.28,31.5 65.28,35.05 65.02,35.31 65.02,37.08 64.77,37.34 64.31,37.34 R34.2 64.26,38.85 FLEX1.-
STRAIN_2
  Top 0.152: DEMUX1.8 59.98,25.44 62.03,27.48 62.03,31.11 62.46,31.55 64.77,31.55 64.97,31.75 64.97,32.82 64.77,33.02 64.31,33.02 R39.2 64.26,34.53 FLEX2.-
STRAIN_3
  Top 0.152: DEMUX1.7 60,26.09 61.72,27.81 61.72,31.16 61.21,31.67 61.21,35.05 60.96,35.31 60.96,37.08 60.71,37.34 60.24,37.34 R35.2 60.18,37.42 FLEX3.-
STRAIN_4
  Top 0.152: DEMUX1.6 60.02,26.74 61.42,28.14 61.42,31.04 60.91,31.55 60.91,32.82 60.71,33.02 60.24,33.02 R42.2 60.2,34.53 FLEX4.-
STRAIN_5
  Top 0.152: DEMUX1.5 59.03,27.43 59.94,27.43 61.11,28.6 61.11,30.86 60.42,31.55 57.35,31.55 57.15,31.75 57.15,35.05 56.9,35.31 56.9,37.08 56.64,37.34 56.18,37.34 R36.2 56.12,37.42 FLEX5.-
STRAIN_6
  Top 0.152: DEMUX1.4 59.01,28.07 59.94,28.07 60.81,28.93 60.81,30.73 60.3,31.24 57.23,31.24 56.84,31.62 56.84,32.82 56.64,33.02 56.18,33.02 R43.2 56.13,34.53 FLEX6.-
STRAIN_7
  Top 0.152: DEMUX1.3 59,28.7 59.94,28.7 60.5,29.26 60.5,30.61 60.17,30.94 57.07,30.94 56.52,31.5 53.34,31.5 53.09,31.75 53.09,35.05 52.83,35.31 52.83,37.08 52.58,37.34 52.11,37.34 R37.2 52.05,37.42 FLEX7.-
STRAIN_8
  Top 0.152: DEMUX1.2 59.94,29.34 60.2,29.59 60.2,30.48 60.05,30.63 56.95,30.63 56.39,31.19 53.21,31.19 52.78,31.62 52.78,32.82 52.58,33.02 52.11,33.02 R44.2 52.07,34.53 FLEX8.-
STRAIN_9
  Top 0.152: DEMUX1.17 65.49,25.44 65.28,25.65 65.28,30.48 66.04,31.24 69.09,31.24 69.34,31.5 69.34,35.05 69.09,35.31 69.09,37.08 68.83,37.34 68.37,37.34 R11.2 68.33,38.85 FLEX9.-
STRAIN_10
  Top 0.152: 66.39,24.89 DEMUX1.16 65.38,24.79 64.97,25.2 64.97,30.61 65.91,31.55 68.83,31.55 69.04,31.75 69.04,32.82 68.83,33.02 68.37,33.02 R38.2 68.33,34.53 FLEX100.-
TEC_1_COLD
  Top 0.152: R27.1 20.57,32 20.95,31.62 22.05,31.62 22.35,31.32 26.23,31.32 27.93,29.62 30.35,29.62 30.6,29.87 PWM_DRIVER1.12
TEC_1_HOT
  Top 0.152: R29.1 22.1,32 22.48,31.62 26.36,31.62 28.06,29.92 29.72,29.92 29.95,30.16 PWM_DRIVER1.13
TEC_2_COLD
  Top 0.152: R23.1 16,32 16.38,31.62 17.48,31.62 17.78,31.32 20.4,31.32 20.7,31.01 21.8,31.01 22.1,30.71 25.98,30.71 27.68,29.01 31.06,29.01 33.2,26.87 PWM_DRIVER1.21
TEC_2_HOT
  Top 0.152: R25.1 17.53,32 17.91,31.62 20.52,31.62 20.83,31.32 21.92,31.32 22.23,31.01 26.11,31.01 27.81,29.31 31.39,29.31 33.85,26.85 PWM_DRIVER1.22
TEC_3_COLD
  Top 0.152: R19.1 11.43,32 11.81,31.62 12.9,31.62 13.21,31.32 15.83,31.32 16.13,31.01 17.22,31.01 17.53,30.71 20.14,30.71 20.45,30.4 21.54,30.4 21.85,30.1 25.73,30.1 27.43,28.4 30.28,28.4 31.9,26.77 PWM_DRIVER1.19
TEC_3_HOT
  Top 0.152: R21.1 12.95,32 13.34,31.62 15.95,31.62 16.26,31.32 17.35,31.32 17.65,31.01 20.27,31.01 20.58,30.71 21.67,30.71 21.97,30.4 25.85,30.4 27.55,28.7 30.73,28.7 32.55,26.88 PWM_DRIVER1.20
TEC_4_COLD
  Top 0.152: R15.1 6.86,32 7.24,31.62 8.33,31.62 8.64,31.32 11.25,31.32 11.56,31.01 12.65,31.01 12.96,30.71 15.57,30.71 15.88,30.4 16.97,30.4 17.28,30.1 19.89,30.1 20.2,29.79 21.29,29.79 21.59,29.49 25.48,29.49 27.18,27.79 29.62,27.79 30.6,26.8 PWM_DRIVER1.17
TEC_4_HOT
  Top 0.152: R17.1 8.38,32 8.76,31.62 11.38,31.62 11.69,31.32 12.78,31.32 13.08,31.01 15.7,31.01 16,30.71 17.1,30.71 17.4,30.4 20.02,30.4 20.32,30.1 21.42,30.1 21.72,29.79 25.6,29.79 27.3,28.09 29.95,28.09 31.25,26.79 PWM_DRIVER1.18
TEC_5_COLD
  Top 0.152: R31.1 2.29,32 2.67,31.62 3.76,31.62 4.07,31.32 6.68,31.32 6.99,31.01 8.08,31.01 8.38,30.71 11,30.71 11.31,30.4 12.4,30.4 12.7,30.1 15.32,30.1 15.62,29.79 16.72,29.79 17.02,29.49 19.64,29.49 19.95,29.18 21.04,29.18 21.34,28.88 25.22,28.88 26.92,27.18 28.96,27.18 29.3,26.83 PWM_DRIVER1.15
TEC_5_HOT
  Top 0.152: R33.1 3.81,32 4.19,31.62 6.81,31.62 7.11,31.32 8.21,31.32 8.51,31.01 11.13,31.01 11.43,30.71 12.53,30.71 12.83,30.4 15.45,30.4 15.75,30.1 16.84,30.1 17.15,29.79 19.77,29.79 20.07,29.49 21.16,29.49 21.47,29.18 25.35,29.18 27.05,27.48 29.29,27.48 29.95,26.82 PWM_DRIVER1.16 29.97,25.75
TX0  (via drill 0.25)
  Top 0.152: JP2.RXI 66.85,11.73 66.85,17.98 66.04,18.8 64.26,18.8 63.48,19.58 63.48,21.23 63.09,21.61 57.88,21.61 v56.93,20.67 | v55.07,22.58 55.07,23.06 55.42,23.42 55.42,23.95 56.74,25.27 56.74,26.04 56.64,26.14 52.55,26.14 v51.82,25.4 | MCU.47 46.28,23.44 45.21,24.51 45.21,25.15 45.52,25.45 47.8,25.45 v48.26,25.91
  Bottom 0.152: v55.07,22.58 55.07,22.53 v56.93,20.67 | v48.26,25.91 48.77,25.4 v51.82,25.4
VBATT
  Top 0.305: D13.K 32.14,17.26 VREG6.1 29.93,17.19 C45.1 C44.1 29.95,15.22 C2.1 27.56,13.08 23.88,9.4 25.95,7.32 C126.1 C127.1 | D8.K 29.05,4.84 VREG1.4 VREG1.3 27.48,7.37
  Top 0.406: 17.19,16.11 VREG7.1 17.1,16.11 | D14.K 20.22,17.86 VREG7.2 | 27.48,7.37 C127.1 | 17.17,5.38 C46.1
  Top 0.508: 17.25,7.86 LED3.A 17.25,7.89
  Top 0.61: VREG7.2 VREG7.1 | 17.1,16.11 C38.1 C37.1 17.1,11.96 C118.1 17.25,8.89 | 17.25,7.86 C46.1 14.1,5.71 12.66,7.16 C120.1 C119.1 12.66,11.16 SW1.S1 | 17.25,8.89 17.25,7.89 | 17.25,8.89 17.76,9.4 23.88,9.4
VCC  (via drill 0.25)
  Top 0.254: HBRIDGE1.7 HBRIDGE1.8 21.61,35.29 22.1,34.8 22.61,34.8 22.86,34.54 C20.1 23.32,33.95 23.62,33.66 v23.62,32.26 | HBRIDGE2.7 HBRIDGE2.8 17.04,35.29 17.53,34.8 18.03,34.8 18.29,34.54 C16.1 18.75,33.95 19.05,33.66 v19.05,32.26 | HBRIDGE3.7 HBRIDGE3.8 12.46,35.29 12.95,34.8 13.46,34.8 13.72,34.54 C12.1 13.76,33.91 14.22,33.91 14.48,33.66 v14.48,32.26 | HBRIDGE4.7 HBRIDGE4.8 7.89,35.29 8.38,34.8 8.89,34.8 9.14,34.54 C8.1 9.61,33.95 9.91,33.66 v9.91,32.26 | HBRIDGE5.7 HBRIDGE5.8 3.32,35.29 3.81,34.8 4.32,34.8 4.57,34.54 C25.1 5.16,33.95 5.33,33.78 v5.33,32.26 | v5.33,30.73 6.48,30.73 6.73,30.48 7.87,30.48 8.26,30.1 v9.91,30.1 10.79,30.1 11.05,29.84 12.19,29.84 12.57,29.46 v14.48,29.46 15.11,29.46 15.37,29.21 16.51,29.21 16.89,28.83 v19.05,28.83 19.56,28.83 19.81,28.57 20.83,28.57 21.21,28.19 v23.62,28.19 25.15,28.19 28.7,24.64 34.92,24.64 35.52,24.05 C99.1 C98.1 37.26,24.05 37.75,24.55 37.75,24.64 | 37.75,24.64 PWM_DRIVER1.28 | D8.A 34.45,4.84 VREG1.5 VREG1.6 36.02,7.37 | C124.1 C123.1 38.18,7.32 38.61,7.75 v38.61,8.64 | 54.42,16.76 MCU.23 58.15,16.78 | C108.1 58.29,16.64 58.15,16.78 | 58.67,16.78 58.15,16.78 | 58.67,16.78 58.92,16.78 59.05,16.64 C109.1 61.68,16.05 | D11.K R46.2 61.89,12.36 62.74,13.21 v62.74,14.99 61.68,16.05 | MCU.54 43.33,18.78 42.8,19.3 42.8,20.83 42.55,21.08 C111.1 C106.1 42.08,22.35 41.83,22.61 | AVR_ISP.2 39.62,28.83 39.62,23.62 38.61,22.61 | 37.75,24.64 38.61,23.78 38.61,22.61 | v59.18,17.53 R40.2 58.34,17.11 58.67,16.78 | R41.2 v59.18,18.54 | 47.78,23.62 MCU.44 | 47.78,23.62 47.78,24.61 47.8,24.59 C116.1 v48.51,24.64
  Top 0.254: v39.37,9.4 39.77,9.79 L3.1 39.77,11.29 36.07,14.99 36.07,20.07 v37.34,21.34 38.86,21.34 40.13,22.61 41.83,22.61 | 38.61,22.61 v38.35,22.35 | 41.83,22.61 43.1,23.88 v44.96,23.88 | v47.24,23.88 47.53,23.88 47.78,23.62 | MCU.34 C107.1 | 61.68,16.05 61.68,19.35 v60.45,20.57 | v56.13,25.65 53.09,25.65 52.79,25.36 C107.1 | v51.82,24.64 C107.1
  Top 0.406: 36.02,7.37 C124.1
  Bottom 0.254: v5.33,32.26 v5.33,30.73 | v9.91,32.26 v9.91,30.1 | v14.48,32.26 v14.48,29.46 | v19.05,32.26 v19.05,28.83 | v23.62,32.26 v23.62,28.19 | v59.18,17.53 v59.18,18.54 | v39.37,9.4 v38.61,8.64 | v38.35,22.35 v37.34,21.34 | v48.51,24.64 v51.82,24.64 | v47.24,23.88 v44.96,23.88 | JP2.VCC v62.74,14.99 | v60.45,20.57 58.17,22.86 58.17,24 56.52,25.65 v56.13,25.65
VIBE_1
  Top 0.152: PWM_DRIVER1.6 34.5,32.85 34.57,32.92 37.84,32.92 38.15,33.22 41.78,33.22 42.09,33.53 45.72,33.53 46.1,33.91 R6.1
VIBE_2
  Top 0.152: R7.1 42.04,33.91 41.66,33.53 38.02,33.53 37.72,33.22 34.16,33.22 33.85,32.91 PWM_DRIVER1.7
VIBE_3
  Top 0.152: R8.1 37.97,33.91 37.59,33.53 34.04,33.53 33.2,32.7 PWM_DRIVER1.8
VIBE_4
  Top 0.152: R9.1 33.91,33.91 32.89,32.89 32.64,32.89 32.55,32.81 PWM_DRIVER1.9
VIBE_5
  Top 0.152: R10.1 29.84,34.16 30.48,33.53 31.37,33.53 31.9,32.99 PWM_DRIVER1.10
VIBE_6
  Top 0.152: R13.1 25.78,34.16 26.42,33.53 30.05,33.53 30.35,33.22 30.99,33.22 31.25,32.96 PWM_DRIVER1.11

## Text on the board
tPlace: TODO | CHECK new pins used (Demux) / CHECK RESISTOR VALUE FOR NEW FLEX SENSORS | Designed by: MrSwirlyEyes | Transmission of Touch VR | Touch Glove Rev 1